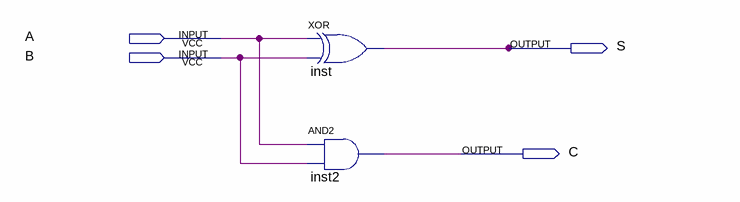
[diagram p0: schematic sheet]
// Quartus schematic HALF_ADDER.bdf as structural Verilog: 2 symbols, 4 pins
module HALF_ADDER (
  input  A,
  input  B,
  output S,
  output C
);

  xor inst (S, A, B);
  and inst2 (C, A, B);
endmodule
